# EAGLE design MainBoard (EAGLE 9.6.2)
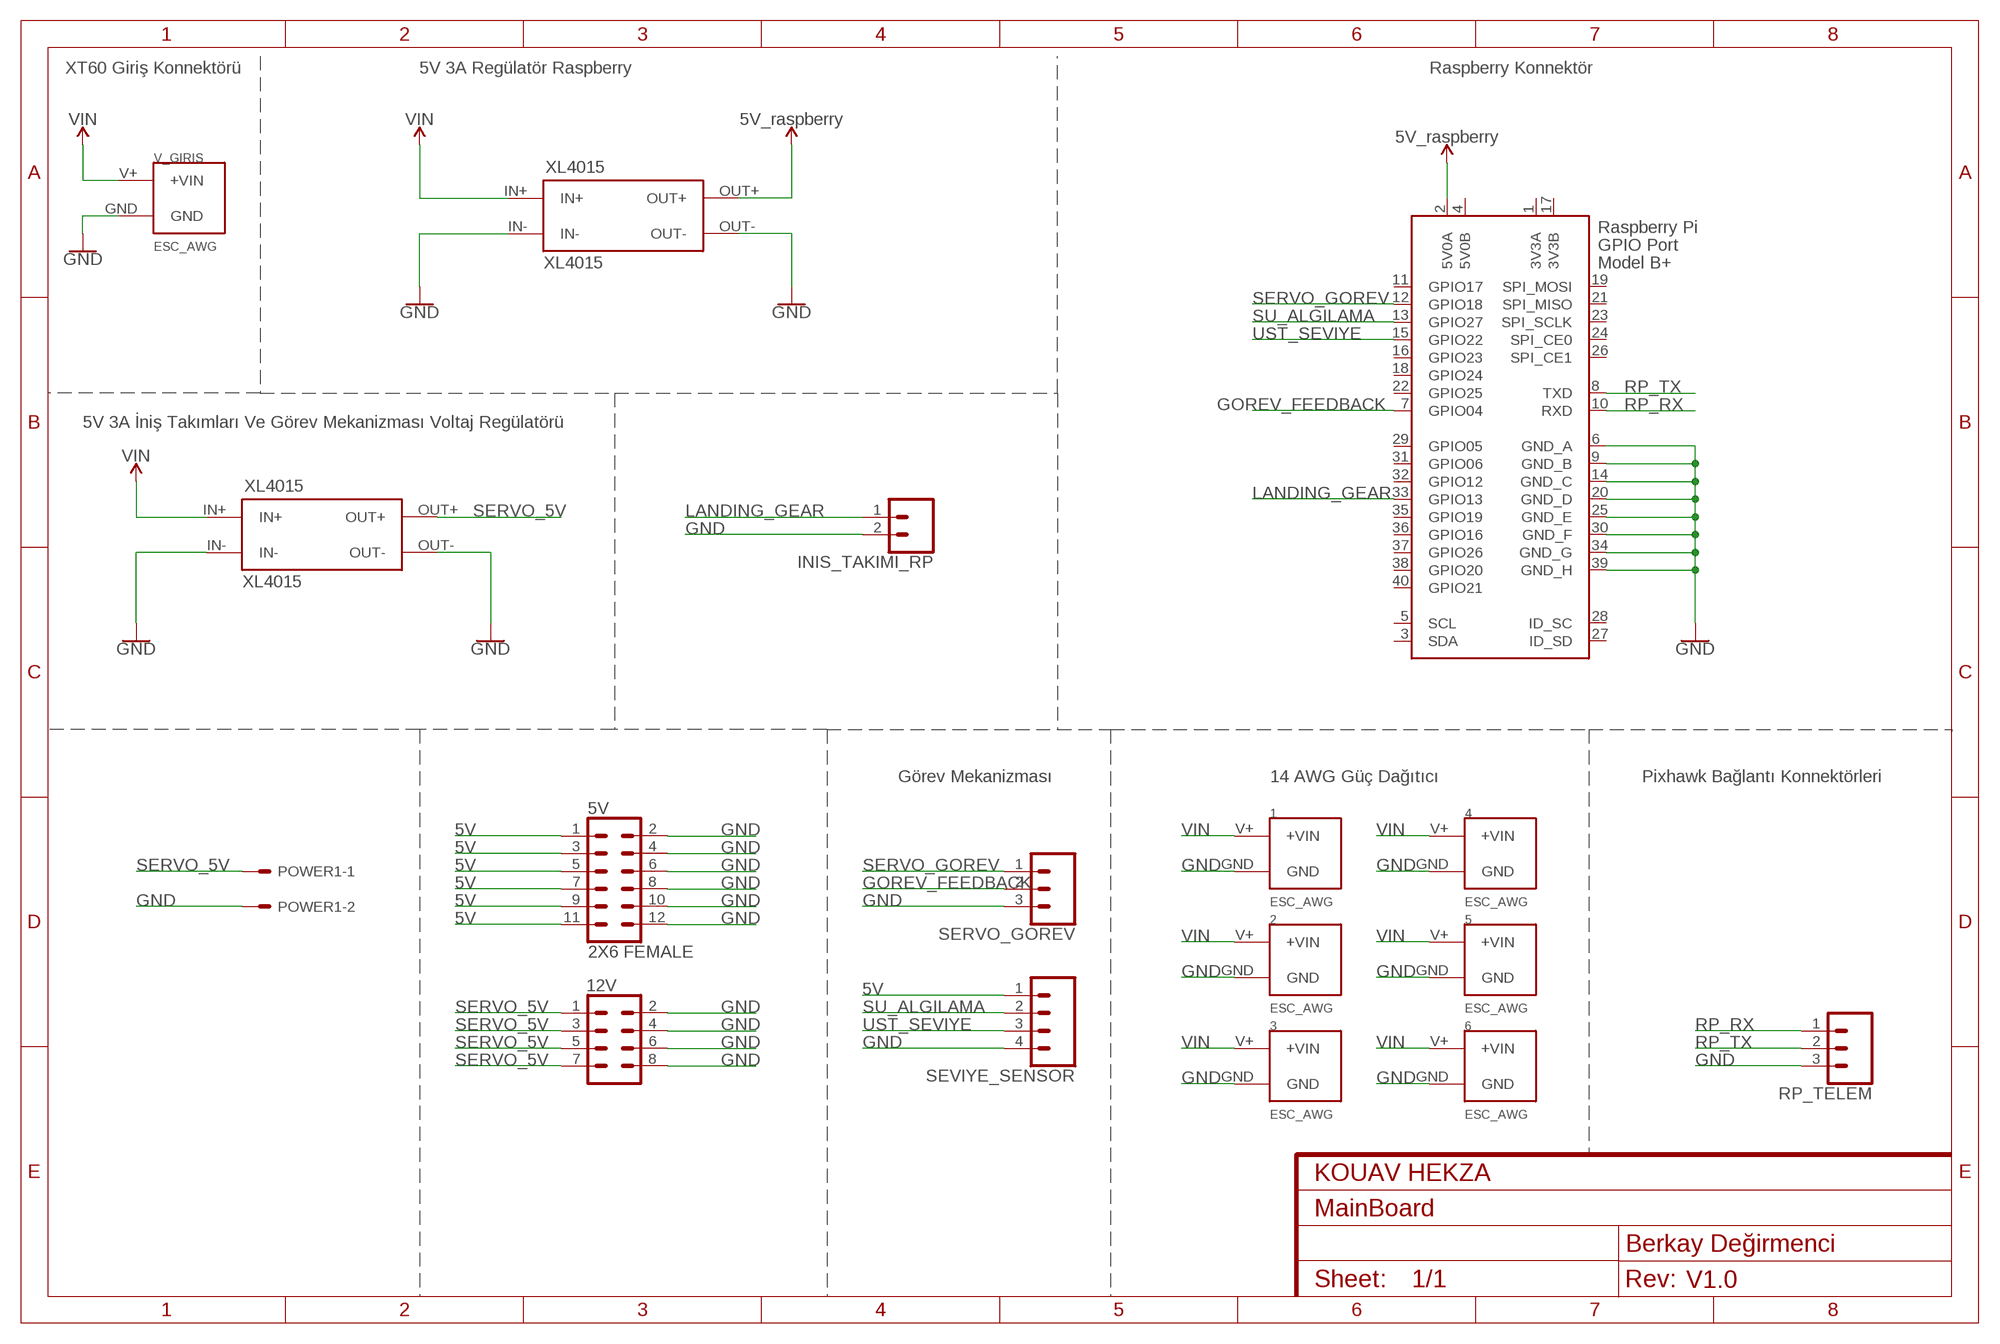
[diagram p0: schematic, sheet 1]
FRAME1 (FRAME-A4L): CNAME: KOUAV HEKZA; CREVISION: V1.0; DESIGNER: Berkay Değirmenci

## Parts
1  ESC_AWG  [ESC_AWG]
2  ESC_AWG  [ESC_AWG]
3  ESC_AWG  [ESC_AWG]
4  ESC_AWG  [ESC_AWG]
5  ESC_AWG  [ESC_AWG]
5V  2X6 FEMALE  CONN_06X2PTH_FEMALE  [2X6]
6  ESC_AWG  [ESC_AWG]
12V  CONN_04X2  [2X4]
INIS_TAKIMI_RP  CONN_02  [1X02]
POWER1  22-27-2021-02  [6410-02]
RP_TELEM  CONN_03  [1X03]
SERVO_GOREV  CONN_03  [1X03]
SEVIYE_SENSOR  CONN_04  [1X04]
U$3  XL4015  [XL4015]
U$4  XL4015  [XL4015]
V_GIRIS  ESC_AWG  [ESC_AWG]
X1  RASPI_BOARD_B+#_E4  [RASPI_BOARD_B+_EDGES_4DRILL]

## Nets
5V: 5V.1 5V.3 5V.5 5V.7 5V.9 5V.11 SEVIYE_SENSOR.1 U$3.OUT+ X1.2(5V0A) ; supply symbol labelled 5V_raspberry
GND: 1.GND 2.GND 3.GND 4.GND 5.GND 5V.2 5V.4 5V.6 5V.8 5V.10 5V.12 6.GND 12V.2 12V.4 12V.6 12V.8 INIS_TAKIMI_RP.2 POWER1.2 RP_TELEM.3 SERVO_GOREV.3 SEVIYE_SENSOR.4 U$3.IN- U$3.OUT- U$4.IN- U$4.OUT- V_GIRIS.GND X1.6(GND_A) X1.9(GND_B) X1.14(GND_C) X1.20(GND_D) X1.25(GND_E) X1.30(GND_F) X1.34(GND_G) X1.39(GND_H)
GOREV_FEEDBACK: SERVO_GOREV.2 X1.7(GPIO04)
LANDING_GEAR: INIS_TAKIMI_RP.1 X1.33(GPIO13)
RP_RX: RP_TELEM.1 X1.10(RXD)
RP_TX: RP_TELEM.2 X1.8(TXD)
SERVO_5V: 12V.1 12V.3 12V.5 12V.7 POWER1.1 U$4.OUT+
SERVO_GOREV: SERVO_GOREV.1 X1.12(GPIO18)
SU_ALGILAMA: SEVIYE_SENSOR.2 X1.13(GPIO27)
UST_SEVIYE: SEVIYE_SENSOR.3 X1.15(GPIO22)
VIN: 1.V+(+VIN) 2.V+(+VIN) 3.V+(+VIN) 4.V+(+VIN) 5.V+(+VIN) 6.V+(+VIN) U$3.IN+ U$4.IN+ V_GIRIS.V+(+VIN)
Unconnected: X1.3(SDA) X1.5(SCL) X1.11(GPIO17) X1.16(GPIO23) X1.18(GPIO24) X1.19(SPI_MOSI) X1.21(SPI_MISO) X1.22(GPIO25) X1.23(SPI_SCLK) X1.24(SPI_CE0) X1.26(SPI_CE1) X1.27(ID_SD) X1.28(ID_SC) X1.29(GPIO05) X1.31(GPIO06) X1.32(GPIO12) X1.35(GPIO19) X1.36(GPIO16) X1.37(GPIO26) X1.38(GPIO20) X1.40(GPIO21)

## Notes on the sheet
- XT60 Giriş Konnektörü | 5V 3A Regülatör Raspberry | Raspberry Konnektör
- 5V 3A İniş Takımları Ve Görev Mekanizması Voltaj Regülatörü
- Görev Mekanizması | 14 AWG Güç Dağıtıcı | Pixhawk Bağlantı Konnektörleri

## Power pins joined to a net without a drawn wire
3V3A: X1.1(3V3A)
3V3B: X1.17(3V3B)
5V0B: X1.4(5V0B)

## Library data of the parts
1-6 V_GIRIS = ESC_AWG:ESC_AWG
5V = SparkFun-Connectors:CONN_06X2: Multi connection point. Often used as Generic Header-pin footprint for 0.1 inch spaced/style header connections On any of the 0.1 inch spaced packages, you can populate with these: Break Away Headers - Straight <https://www.sparkfun.com/products/116> (PRT-00116) Break Away Male Headers - Right Angle <https://www.sparkfun.com/products/553> (PRT-00553) Female Headers <https://www.sparkfun.com/products/115> (PRT-00115) Break Away Headers - Machine Pin <https://www.sparkfun.com/products/117> (PRT-00117) Break Away Female Headers - Swiss Machine Pin <https://www.sparkfun.com/products/743> (PRT-00743); PROD_ID: CONN-12423
12V = SparkFun-Connectors:CONN_04X2: Multi connection point. Often used as Generic Header-pin footprint for 0.1 inch spaced/style header connections On any of the 0.1 inch spaced packages, you can populate with these: Break Away Headers - Straight <https://www.sparkfun.com/products/116> (PRT-00116) Break Away Male Headers - Right Angle <https://www.sparkfun.com/products/553> (PRT-00553) Female Headers <https://www.sparkfun.com/products/115> (PRT-00115) Break Away Headers - Machine Pin <https://www.sparkfun.com/products/117> (PRT-00117) Break Away Female Headers - Swiss Machine Pin <https://www.sparkfun.com/products/743> (PRT-00743)
INIS_TAKIMI_RP = SparkFun-Connectors:CONN_02: Multi connection point. Often used as Generic Header-pin footprint for 0.1 inch spaced/style header connections On any of the 0.1 inch spaced packages, you can populate with these: Break Away Headers - Straight <https://www.sparkfun.com/products/116> (PRT-00116) Break Away Male Headers - Right Angle <https://www.sparkfun.com/products/553> (PRT-00553) Female Headers <https://www.sparkfun.com/products/115> (PRT-00115) Break Away Headers - Machine Pin <https://www.sparkfun.com/products/117> (PRT-00117) Break Away Female Headers - Swiss Machine Pin <https://www.sparkfun.com/products/743> (PRT-00743) For SCREWTERMINALS and SPRING TERMINALS visit here: Screw Terimnals on SparkFun.com <https://www.sparkfun.com/search/results?term=Screw+Terminals> (5mm/3.5mm/2.54mm spacing) This device is also useful as a general connection point to wire up your design to another part of your project. Our various solder wires solder well into these plated through hole pads. Hook-Up Wire - Assortment (Stranded, 22 AWG) <https://www.sparkfun.com/products/11375> (PRT-11375) Hook-Up Wire - Assortment (Solid Core, 22 AWG) <https://www.sparkfun.com/products/11367> (PRT-11367) View the entire wire category on our website here <https://www.sparkfun.com/categories/141> Special notes: Molex polarized connector foot print use with: PRT-08233 with associated crimp pins and housings. 2.54_SCREWTERM for use with PRT-10571. 3.5mm Screw Terminal footprints for PRT-08084 5mm Screw Terminal footprints for use with PRT-08432
POWER1 = con-molex:22-?-02: CONNECTOR wire to board 2.54 mm (.1 inch) pitch header; MF: MOLEX; OC_FARNELL: unknown; OC_NEWARK: unknown
RP_TELEM SERVO_GOREV = SparkFun-Connectors:CONN_03: Multi connection point. Often used as Generic Header-pin footprint for 0.1 inch spaced/style header connections On any of the 0.1 inch spaced packages, you can populate with these: Break Away Headers - Straight <https://www.sparkfun.com/products/116> (PRT-00116) Break Away Male Headers - Right Angle <https://www.sparkfun.com/products/553> (PRT-00553) Female Headers <https://www.sparkfun.com/products/115> (PRT-00115) Break Away Headers - Machine Pin <https://www.sparkfun.com/products/117> (PRT-00117) Break Away Female Headers - Swiss Machine Pin <https://www.sparkfun.com/products/743> (PRT-00743) Stackable Header - 3 Pin (Female, 0.1") <https://www.sparkfun.com/products/13875> (PRT-13875) For SCREWTERMINALS and SPRING TERMINALS visit here: Screw Terimnals on SparkFun.com <https://www.sparkfun.com/search/results?term=Screw+Terminals> (5mm/3.5mm/2.54mm spacing) This device is also useful as a general connection point to wire up your design to another part of your project. Our various solder wires solder well into these plated through hole pads. Hook-Up Wire - Assortment (Stranded, 22 AWG) <https://www.sparkfun.com/products/11375> (PRT-11375) Hook-Up Wire - Assortment (Solid Core, 22 AWG) <https://www.sparkfun.com/products/11367> (PRT-11367) View the entire wire category on our website here <https://www.sparkfun.com/categories/141> Special notes: Molex polarized connector foot print use with SKU : PRT-08232 with associated crimp pins and housings.
SEVIYE_SENSOR = SparkFun-Connectors:CONN_04: Multi connection point. Often used as Generic Header-pin footprint for 0.1 inch spaced/style header connections On any of the 0.1 inch spaced packages, you can populate with these: Break Away Headers - Straight <https://www.sparkfun.com/products/116> (PRT-00116) Break Away Male Headers - Right Angle <https://www.sparkfun.com/products/553> (PRT-00553) Female Headers <https://www.sparkfun.com/products/115> (PRT-00115) Break Away Headers - Machine Pin <https://www.sparkfun.com/products/117> (PRT-00117) Break Away Female Headers - Swiss Machine Pin <https://www.sparkfun.com/products/743> (PRT-00743) For SCREWTERMINALS and SPRING TERMINALS visit here: Screw Terimnals on SparkFun.com <https://www.sparkfun.com/search/results?term=Screw+Terminals> (5mm/3.5mm/2.54mm spacing) This device is also useful as a general connection point to wire up your design to another part of your project. Our various solder wires solder well into these plated through hole pads. Hook-Up Wire - Assortment (Stranded, 22 AWG) <https://www.sparkfun.com/products/11375> (PRT-11375) Hook-Up Wire - Assortment (Solid Core, 22 AWG) <https://www.sparkfun.com/products/11367> (PRT-11367) View the entire wire category on our website here <https://www.sparkfun.com/categories/141> Special notes: Molex polarized connector foot print use with SKU : PRT-08231 with associated crimp pins and housings. 1MM SMD Version SKU: PRT-10208; PROD_ID: CONN-09696
U$3 U$4 = voltaj_regulator:XL4015
X1 = raspberrypi_bastelstube_v13:RASPI_BOARD_B+#: Raspberry Pi GPIO connector with markings for the outer dimensions of the Raspberry Pi board model B+ with different sets of drill holes or mounting pads All pins connected

## Board
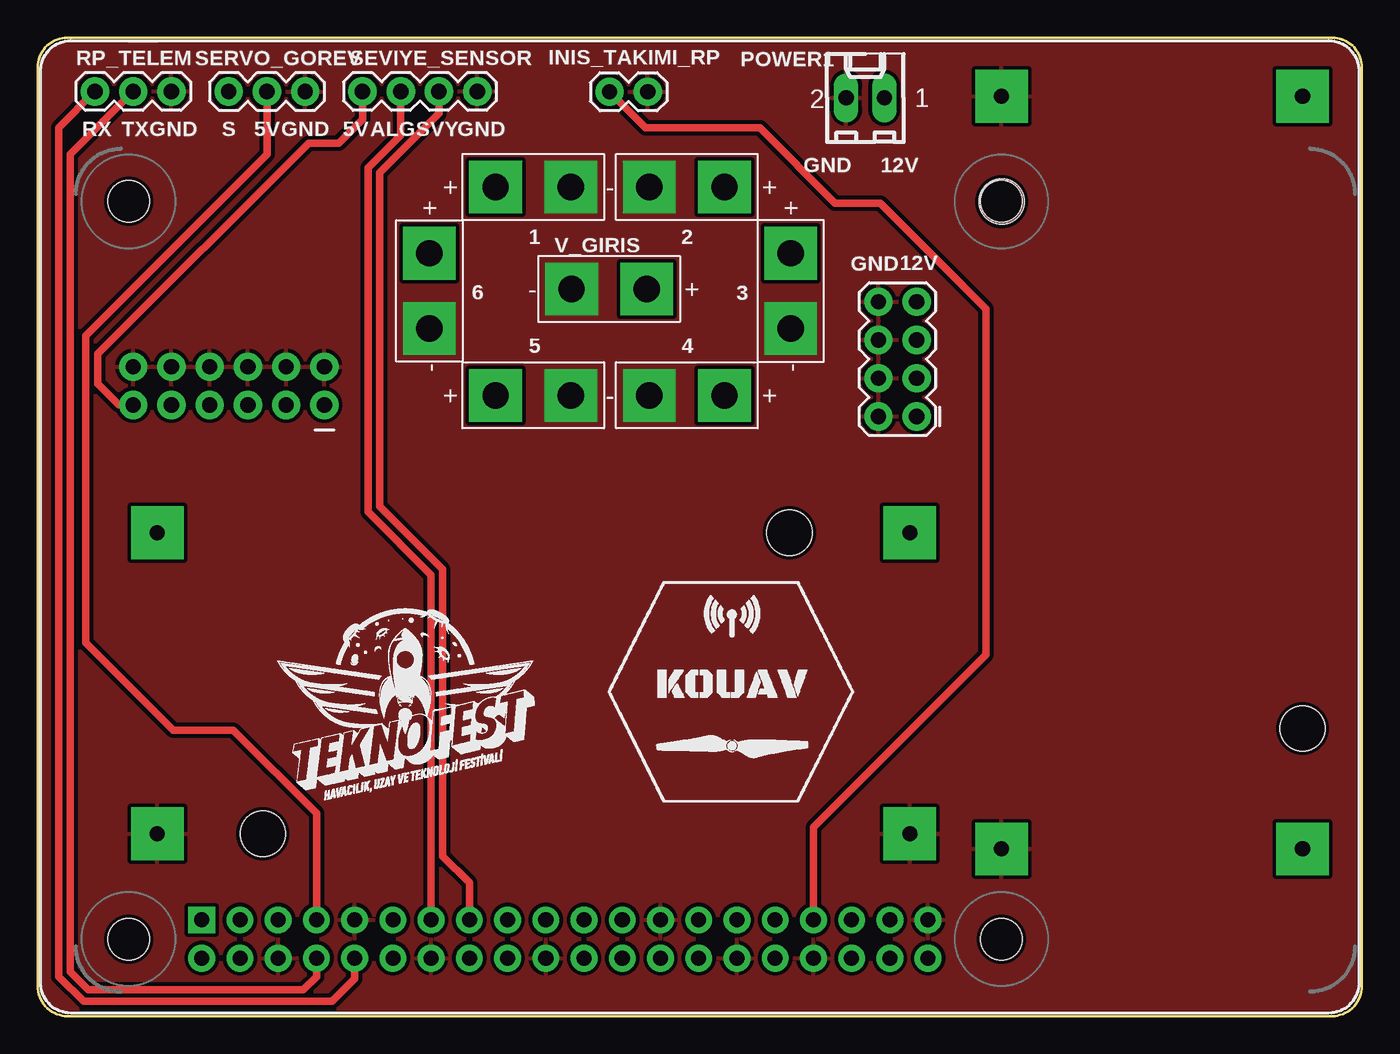
[diagram p1: board, top side]
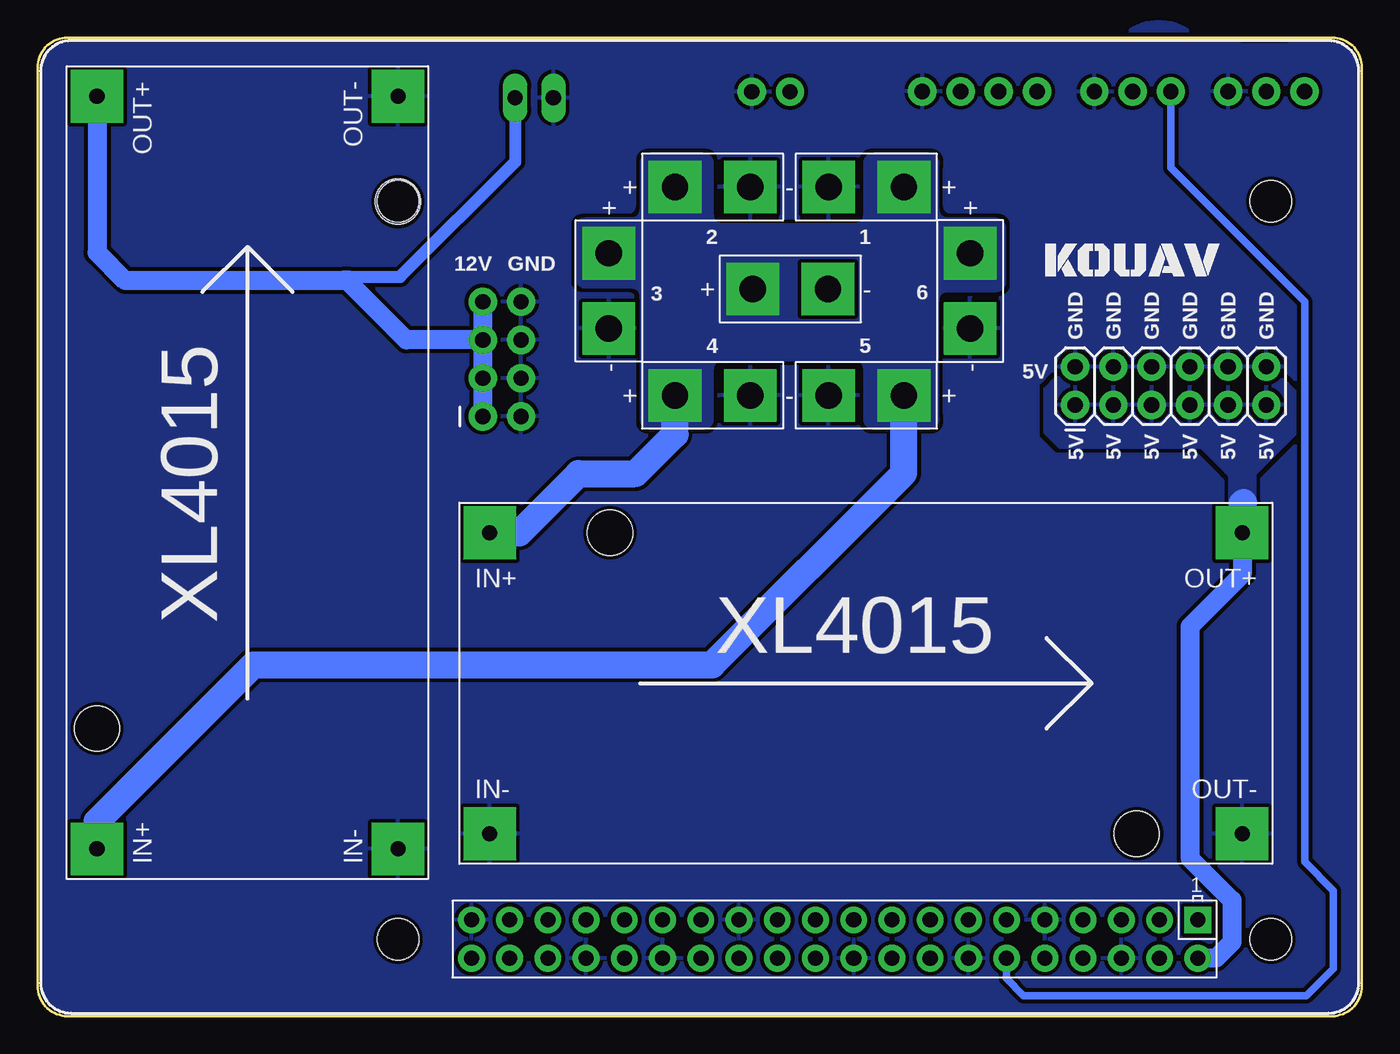
[diagram p2: board, bottom side, seen from below]

Size 88 x 65 mm. Coordinates in mm from the lower left corner, seen from the top.
Outline: 5,65 2,65 arc90 0,63 0,2 arc90 2,0 86,0 arc90 88,2 88,63 arc90 86,65 8,65 5,65
Outline: 5,65 6,65
Copper layers (1*16): Top 0.035mm / dielectric 1.5mm / Bottom 0.035mm
Design rules "SparkFun *": minimum track width 8mil, minimum drill 0.3mm, track to track 10mil, track to pad 8mil, pad to pad 8mil, via to via 8mil, smd to smd 8mil, copper to edge 10mil, drill to drill 8mil, minimum pad ring 12mil, minimum via ring 10mil, stop-mask expansion 4mil, vias tented up to drill 25mil, thermal gap 10mil

### Footprints (pad centres in the part's own frame; a part is rotated, then mirrored left to right if it is on the bottom)
ESC_AWG = drill 1.75 pad 3.5 square: GND 0,0; V+ 5,0
2X6 = drill 1.016 pad 1.88: 1 0,0; 2 0,2.54; 3 2.54,0; 4 2.54,2.54; 5 5.08,0; 6 5.08,2.54; 7 7.62,0; 8 7.62,2.54; 9 10.16,0; 10 10.16,2.54; 11 12.7,0; 12 12.7,2.54
2X4 = drill 1.016 pad 1.88: 1 -3.81,-1.27; 2 -3.81,1.27; 3 -1.27,-1.27; 4 -1.27,1.27; 5 1.27,-1.27; 6 1.27,1.27; 7 3.81,-1.27; 8 3.81,1.27
1X02 = drill 1.016 pad 1.88: 1 0,0; 2 2.54,0
6410-02 = drill 1.016 long: 1 1.27,0; 2 -1.27,0
1X03 = drill 1.016 pad 1.88: 1 0,0; 2 2.54,0; 3 5.08,0
1X04 = drill 1.016 pad 1.88: 1 0,0; 2 2.54,0; 3 5.08,0; 4 7.62,0
XL4015 = drill 1 pad 3.5 square: IN+ 2,-2; IN- 2,-22; OUT+ 52,-2; OUT- 52,-22 | hole 3: 10,-2; 45,-22
RASPI_BOARD_B+_EDGES_4DRILL = drill 1 pad 1.778 square: 1 8.37,51.23 | drill 1 pad 1.778: 2 8.37,53.77; 3 10.91,51.23; 4 10.91,53.77; 5 13.45,51.23; 6 13.45,53.77; 7 15.99,51.23; 8 15.99,53.77; 9 18.53,51.23; 10 18.53,53.77; 11 21.07,51.23; 12 21.07,53.77; 13 23.61,51.23; 14 23.61,53.77; 15 26.15,51.23; 16 26.15,53.77; 17 28.69,51.23; 18 28.69,53.77; 19 31.23,51.23; 20 31.23,53.77; 21 33.77,51.23; 22 33.77,53.77; 23 36.31,51.23; 24 36.31,53.77; 25 38.85,51.23; 26 38.85,53.77; 27 41.39,51.23; 28 41.39,53.77; 29 43.93,51.23; 30 43.93,53.77; 31 46.47,51.23; 32 46.47,53.77; 33 49.01,51.23; 34 49.01,53.77; 35 51.55,51.23; 36 51.55,53.77; 37 54.09,51.23; 38 54.09,53.77; 39 56.63,51.23; 40 56.63,53.77 | hole 2.75: 3.5,3.5; 3.5,52.5; 61.5,3.5; 61.5,52.5

### Placement (x,y rotation side)
1  35.43,55.08 180 top
2  40.64,55.08 0 top
3  50.04,45.68 90 bottom
4  40.64,41.24 0 top
5  35.43,41.24 180 top
5V  19.05,40.6 0 bottom
6  26.04,45.68 90 top
12V  57.15,43.65 90 top
INIS_TAKIMI_RP  38,61.4 0 top
POWER1  55,61 0 top
RP_TELEM  3.81,61.43 0 top
SERVO_GOREV  12.7,61.42 0 top
SEVIYE_SENSOR  21.59,61.43 0 top
U$1  [KOUAV_LOGO]  40.45,12.17 0 top
U$2  [TEKNOFEST_LOGO]  15.61,11.92 0 top
U$3  59.96,34.11 0 bottom
U$4  86.06,9.11 90 bottom
U$6  [KOUAV_YAZI]  21.99,47.63 0 bottom
V_GIRIS  35.48,48.3 0 top
X1  2.54,57.62 180 bottom

### Tracks (layer width: path | path; a pad name or v marks a point on that pad's centre or on a via)
5V
  Top 0.508: 5V.11 5.4,40.6 4,42 4,44 18,58 20,58 21.59,59.59 SEVIYE_SENSOR.1
  Bottom 1.27: U$3.OUT+ 7.96,29.34 11.43,25.87 11.43,10.5 8.64,7.71 8.64,4.91 9.7,3.85 X1.2
  Bottom 1.778: U$3.OUT+ 7.96,34.04 7.87,34.12
  pour Bottom: 12.7,42.38 20.32,42.38 21.08,41.62 21.08,38.82 20.07,37.81 18.92,37.81 10.67,37.81 9.02,36.16 8.76,35.9 8.76,32.98 8.64,33.11 7.11,33.11 7.11,36.03 4.45,38.7 4.45,40.86 4.45,41.49 5.33,42.38
GND
  pour Top (no thermals): 38.1,57.62 42.55,57.62 arc-90 43.18,56.98 43.18,56.35 43.18,53.43 arc90 43.81,52.79 46.23,52.79 47.12,52.79 arc-90 47.75,52.16 47.75,51.27 47.75,48.86 arc90 48.39,48.22 50.42,48.22 51.56,48.22 arc-90 52.2,47.59 52.2,46.44 52.2,44.03 arc-90 51.56,43.4 50.16,43.4 43.81,43.4 43.56,43.4 arc90 42.93,42.76 42.93,42.38 42.93,39.71 arc-90 42.29,39.08 40.51,39.08 33.78,39.08 arc-90 33.15,39.71 33.15,40.22 33.15,42.76 arc90 32.51,43.4 30.99,43.4 24.38,43.4 arc-90 23.88,43.9 23.88,44.79 23.88,47.33 arc-90 24.51,47.97 25.53,47.97 27.69,47.97 arc90 28.32,48.6 28.32,49.49 28.32,52.16 arc-90 28.96,52.79 30.48,52.79 32.51,52.79 arc90 33.15,53.43 33.15,55.08 33.15,56.98 arc-90 33.78,57.62 37.97,57.62
  pour Top (isolate 0.254, rank 2): 88,62.9 88,2 arc-90 86,0 2,0 arc-90 0,2 0,62.9 arc-90 2,64.9 86,64.9 arc-90
  pour Bottom (isolate 0.254, rank 2): 88,63 88,2 arc-90 86,0 2,0 arc-90 0,2 0,63 arc-90 2,65 86,65 arc-90
  pour Bottom (isolate 0.254): 16,65 11,65 arc-90
GOREV_FEEDBACK
  Top 0.508: X1.7 18.53,13.47 13,19 9,19 4,24 3.2,24.8 3.2,45.2 4,46 6,48 15.24,57.24 SERVO_GOREV.2
LANDING_GEAR
  Top 0.508: X1.33 51.55,12.55 63,24 63,47 56,54 53,54 48,59 40.4,59 INIS_TAKIMI_RP.1
RP_RX
  Top 0.508: RP_TELEM.1 1.4,59.02 1.4,2.63 3.05,0.98 19.56,0.98 21.07,2.49 X1.10
RP_TX
  Top 0.508: RP_TELEM.2 2.16,57.24 2.16,2.95 3.36,1.74 17.65,1.74 18.54,2.63 18.54,3.84 X1.8
SERVO_5V
  Bottom 0.813: POWER1.1 56.27,56.73 63.9,49.1 67.19,49.1 | 67.44,48.86 67.19,49.1 | 67.19,49.1 67.76,49.1 68,48.86
  Bottom 1.27: 12V.7 12V.5 | 12V.5 12V.3 12V.1 | U$4.OUT+ 84.06,50.74 82.17,48.86 68,48.86 67.44,48.86 63.5,44.92 12V.5
SERVO_GOREV
  Bottom 0.508: SERVO_GOREV.1 12.7,56.35 3.81,47.46 3.81,10.25 1.91,8.34 1.91,3.14 3.68,1.36 22.48,1.36 23.62,2.5 23.62,3.84 X1.12
SU_ALGILAMA
  Top 0.508: SEVIYE_SENSOR.2 24.13,58.51 21.97,56.35 21.97,33.49 26.16,29.3 26.16,6.4 X1.13
UST_SEVIYE
  Top 0.406: 28.7,6.4 X1.15
  Top 0.508: SEVIYE_SENSOR.3 26.67,59.97 22.73,56.03 22.73,33.87 26.92,29.68 26.92,10.63 28.7,8.85 28.7,6.4
VIN
  Bottom 1.778: U$4.IN+ 84.06,12.94 73.66,23.33 43.18,23.33 30.43,36.08 5.V+ | U$3.IN+ 55.99,32.11 52.07,36.03 48.26,36.03 45.64,38.65 4.V+
  pour Bottom (no thermals): 28.19,53.81 28.19,56.6 arc-90 28.83,57.24 29.34,57.24 32.38,57.24 arc-90 33.02,56.6 33.02,53.17 arc90 33.66,52.54 33.78,52.54 42.55,52.54 arc90 43.18,53.17 43.18,53.81 43.18,56.6 arc-90 43.81,57.24 44.45,57.24 47.24,57.24 arc-90 47.88,56.6 47.88,53.56 arc90 48.51,52.92 49.78,52.92 51.56,52.92 arc-90 52.2,52.29 52.2,51.65 52.2,49.11 arc-90 51.56,48.48 50.67,48.48 48.51,48.48 arc90 47.88,47.84 47.88,47.71 47.88,39.71 arc-90 47.24,39.08 46.61,39.08 43.81,39.08 arc-90 43.18,39.71 43.18,41.11 43.18,43.02 arc90 42.55,43.65 36.83,43.65 33.66,43.65 arc90 33.02,43.02 33.02,42.38 33.02,39.71 arc-90 32.38,39.08 30.61,39.08 28.83,39.08 arc-90 28.19,39.71 28.19,40.48 28.19,47.59 arc90 27.56,48.22 26.04,48.22 24.38,48.22 arc-90 23.75,48.86 23.75,50.51 23.75,52.29 arc-90 24.38,52.92 25.91,52.92 27.56,52.92 arc90 28.19,53.56

### Text on the board
tPlace: RX | TX | GND | S | 5V | GND | 5V | ALG | SVY | GND | GND | 12V | GND
bPlace: GND | 12V | GND | GND | GND | GND | GND | GND | 5V | 5V | 5V | 5V | 5V | 5V
tStop: AHMET BERKAY / DEĞİRMENCİ
bStop: AHMET BERKAY / DEĞİRMENCİ